# EAGLE schematic OLM7 (EAGLE 6.4)
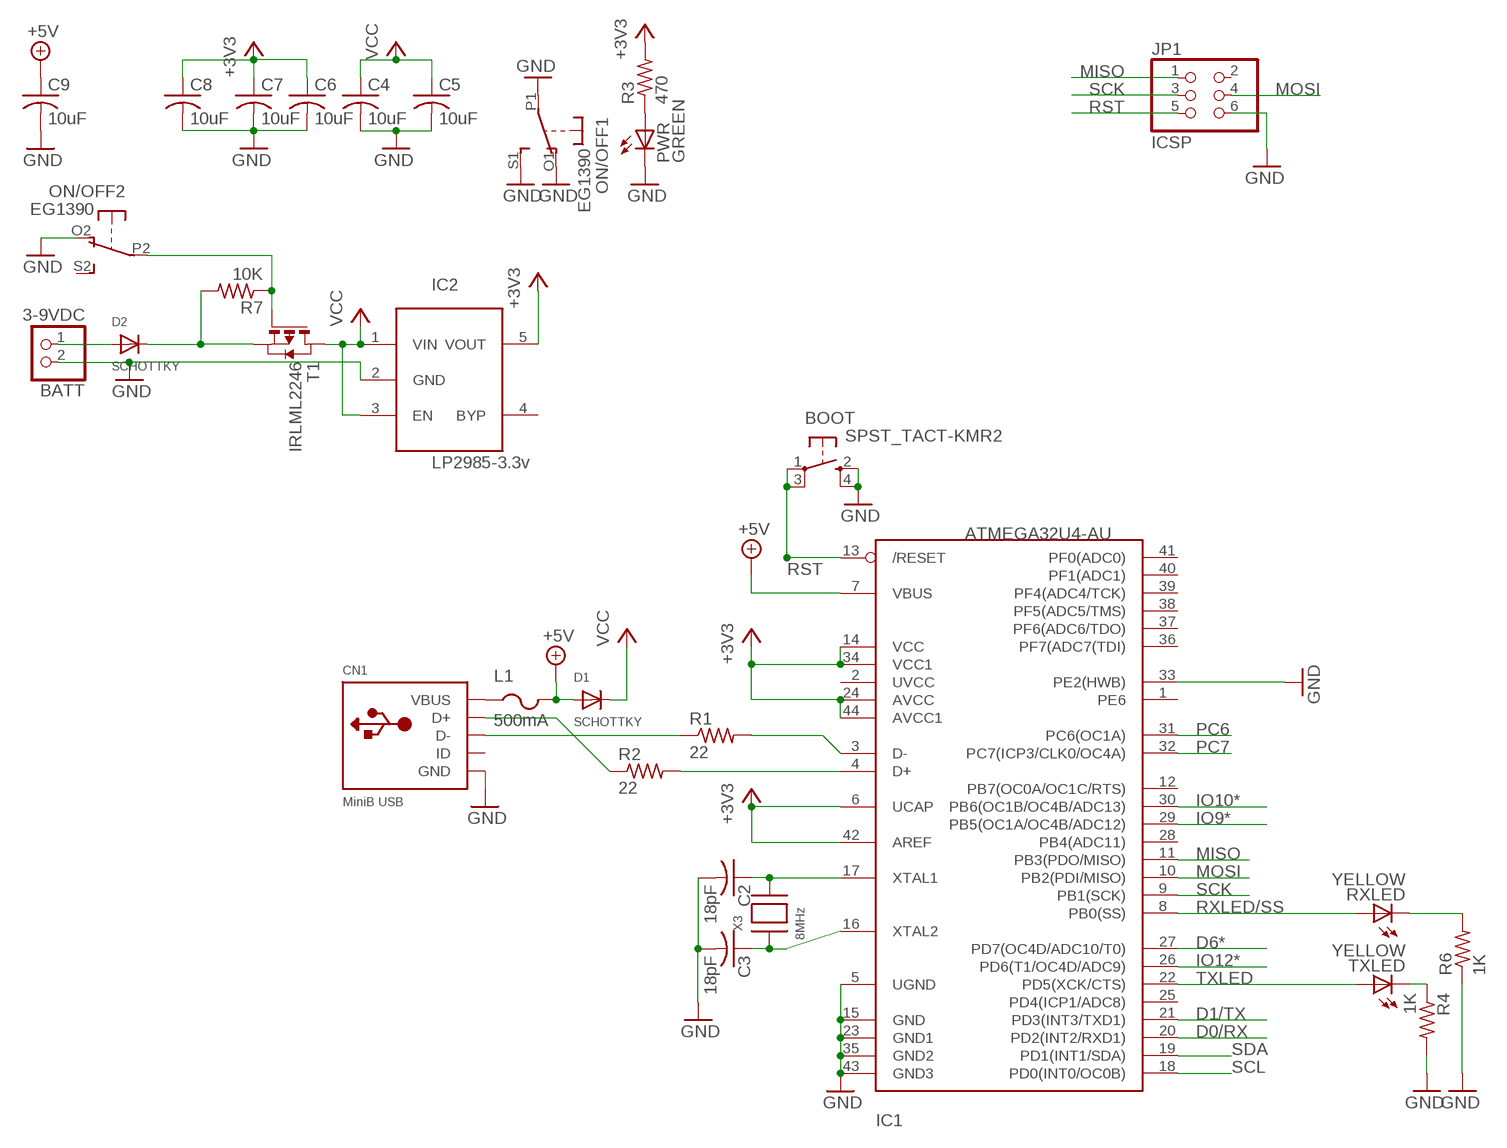
[diagram p0: schematic, sheet 1, part 1 of 2]
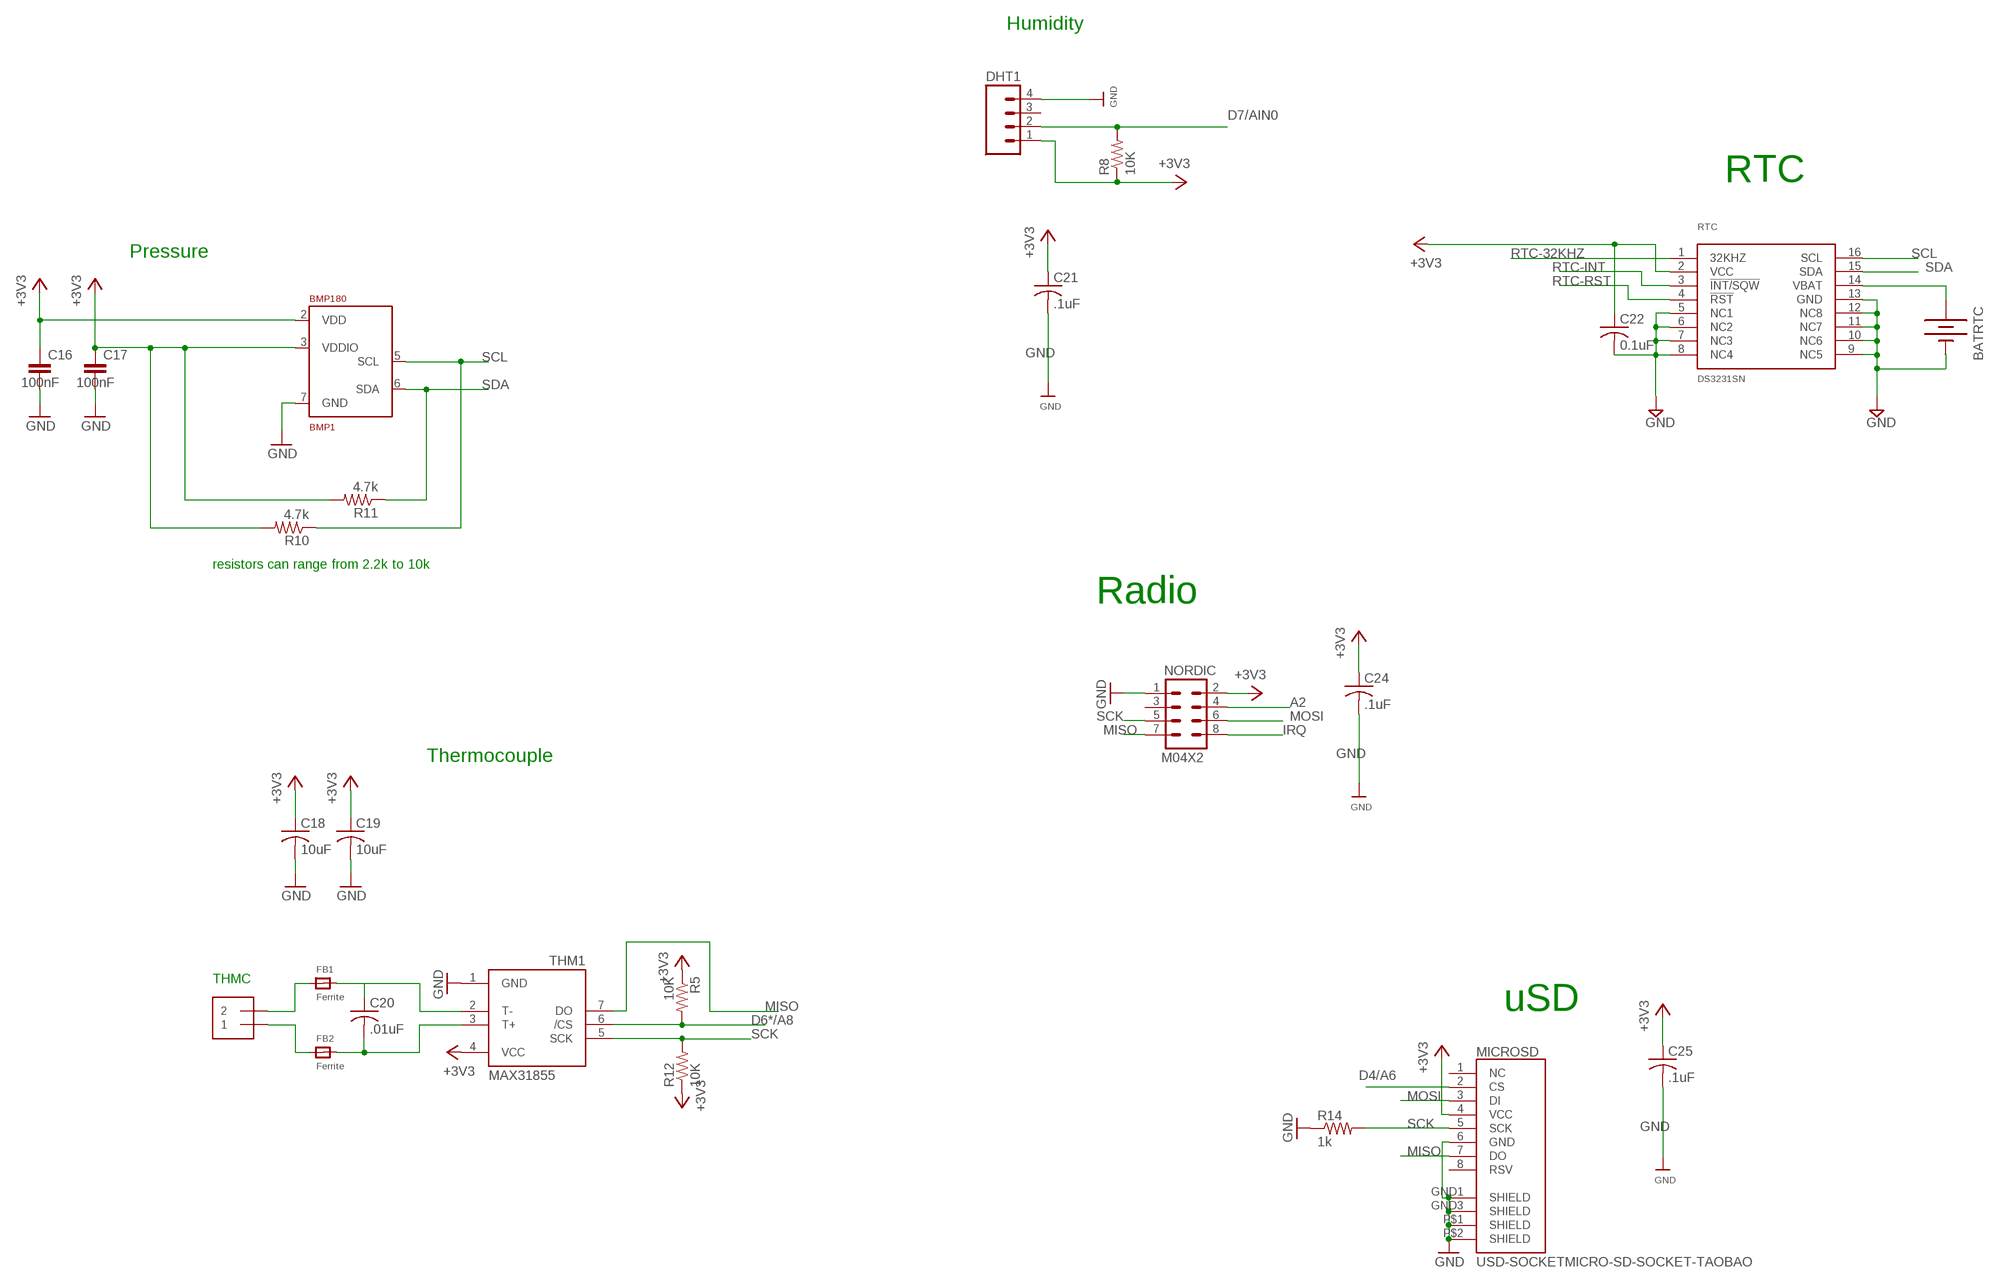
[diagram p1: schematic, sheet 1, part 2 of 2]

## Parts
BATRTC  BATTERYBATTERY_12MM_SMT  [BATTCON_12MM_SMT]
BATT  3-9VDC  JST_2PIN-SMT-RA  [JST-PH-2-SMT-RA]
BMP1  BMP180  [LGA7]
BOOT  SPST_TACT-KMR2  [KMR2]
C2  18pF  C-USC0805K  [C0805K]
C3  18pF  C-USC0805K  [C0805K]
C4  10uF  C-USC0805K  [C0805K]
C5  10uF  C-USC0805K  [C0805K]
C6  10uF  C-USC0805K  [C0805K]
C7  10uF  C-USC0805K  [C0805K]
C8  10uF  C-USC0805K  [C0805K]
C9  10uF  C-USC0805K  [C0805K]
C16  100nF  C-EUC0805  [C0805]
C17  100nF  C-EUC0805  [C0805]
C18  10uF  C-USC0805  [C0805]
C19  10uF  C-USC0805  [C0805]
C20  .01uF  C-USC0805  [C0805]
C21  .1uF  C-USC0805  [C0805]
C22  0.1uF  C-USC0805  [C0805]
C24  .1uF  C-USC0805  [C0805]
C25  .1uF  C-USC0805  [C0805]
CN1  MiniB USB  USBMINIBLARGE  [USB-MINIB_LARGER]
D1  SCHOTTKY  DIODESOD-123  [SOD-123]
D2  SCHOTTKY  DIODESOD-123  [SOD-123]
DHT1  M04LOCK  [1X04_LOCK]
FB1  Ferrite  FERRITE_0805  [_0805]
FB2  Ferrite  FERRITE_0805  [_0805]
IC1  ATMEGA32U4-AU  [TQFP44]
IC2  LP2985-3.3v  LP298XS  [SOT23-5L]
JP1  ICSP  PINHD-2X3  [2X03]
L1  500mA  PTCFUSE-1206  [R1206]
MICROSD  USD-SOCKETMICRO-SD-SOCKET-TAOBAO  [MICRO-SD-SOCKET-TAOBAO]
NORDIC  M04X2  [2X4]
ON/OFF  EG1390  DPDT-EG1390  [EG1390]
PWR  GREEN  LEDCHIPLED_0805  [CHIPLED_0805]
R1  22  R-US_R0805  [R0805]
R2  22  R-US_R0805  [R0805]
R3  470  R-US_R0805  [R0805]
R4  1K  R-US_R0805  [R0805]
R5  10K  R-US_R0805  [R0805]
R6  1K  R-US_R0805  [R0805]
R7  10K  R-US_R0805  [R0805]
R8  10K  R-US_R0805  [R0805]
R10  4.7k  R-US_R0805  [R0805]
R11  4.7k  R-US_R0805  [R0805]
R12  10K  R-US_R0805  [R0805]
R14  1k  R-US_R0805  [R0805]
RTC  DS3231SN  [SO16W]
RXLED  YELLOW  LEDCHIPLED_0805  [CHIPLED_0805]
T1  IRLML2246  PMOSSOT23  [SOT-23]
THM1  MAX31855  MAX6675  [SO08]
THMC  1X2-3.5MM  [1X2-3.5MM]
TXLED  YELLOW  LEDCHIPLED_0805  [CHIPLED_0805]
X3  8MHz  XTALNX5032  [NX5032]

## Nets
+3V3: BMP1.2(VDD) BMP1.3(VDDIO) C6.1 C7.1 C8.1 C16.1 C17.1 C18.1 C19.1 C21.1 C22.1 C24.1 C25.1 DHT1.1 IC1.6(UCAP) IC1.14(VCC) IC1.24(AVCC) IC1.34(VCC1) IC1.42(AREF) IC1.44(AVCC1) IC2.5(VOUT) MICROSD.4(VCC) NORDIC.2 R3.2 R5.1 R8.1 R10.2 R11.2 R12.1 RTC.2(VCC) THM1.4(VCC)
+5V: C9.1 D1.A IC1.7(VBUS) L1.2
A2: NORDIC.4
D0/RX: IC1.20(PD2(INT2/RXD1))
D1/TX: IC1.21(PD3(INT3/TXD1))
D4/A6: MICROSD.2(CS)
D6*: IC1.27(PD7(OC4D/ADC10/T0))
D6*/A8: R5.2 THM1.6(/CS)
D7/AIN0: DHT1.2 R8.2
GND: BATRTC.P$1(-) BATT.2 BMP1.7(GND) BOOT.2(S) BOOT.4(S1) C2.2 C3.2 C4.2 C5.2 C6.2 C7.2 C8.2 C9.2 C16.2 C17.2 C18.2 C19.2 C21.2 C22.2 C24.2 C25.2 CN1.GND DHT1.4 IC1.5(UGND) IC1.15(GND) IC1.23(GND1) IC1.33(PE2(HWB)) IC1.35(GND2) IC1.43(GND3) IC2.2(GND) JP1.6 MICROSD.6(GND) MICROSD.GND1(SHIELD) MICROSD.GND3(SHIELD) MICROSD.P$1(SHIELD) MICROSD.P$2(SHIELD) NORDIC.1 ON/OFF.O1(1:O) ON/OFF.O2(2:O) ON/OFF.P1(1:P) ON/OFF.S1(1:S) PWR.C R4.2 R6.1 R14.1 RTC.5(NC1) RTC.6(NC2) RTC.7(NC3) RTC.8(NC4) RTC.9(NC5) RTC.10(NC6) RTC.11(NC7) RTC.12(NC8) RTC.13(GND) THM1.1(GND)
IO9*: IC1.29(PB5(OC1A/OC4B/ADC12))
IO10*: IC1.30(PB6(OC1B/OC4B/ADC13))
IO12*: IC1.26(PD6(T1/OC4D/ADC9))
IRQ: NORDIC.8
MISO: IC1.11(PB3(PDO/MISO)) JP1.1 MICROSD.7(DO) NORDIC.7 THM1.7(DO)
MOSI: IC1.10(PB2(PDI/MISO)) JP1.4 MICROSD.3(DI) NORDIC.6
N$1: PWR.A R3.1
N$2: CN1.D+ R2.1
N$3: IC1.3(D-) R1.2
N$4: IC1.4(D+) R2.2
N$5: CN1.D- R1.1
N$6: D2.C R7.2 T1.2(S)
N$7: BATT.1 D2.A
N$8: C2.1 IC1.17(XTAL1) X3.P$2
N$9: C3.1 IC1.16(XTAL2) X3.P$1
N$11: R4.1 TXLED.C
N$12: R6.2 RXLED.C
N$13: ON/OFF.P2(2:P) R7.1 T1.3(G)
N$22: BATRTC.P$2(+) RTC.14(VBAT)
N$23: FB1.1 THMC.2
N$24: C20.1 FB1.2 THM1.2(T-)
N$25: FB2.1 THMC.1
N$26: C20.2 FB2.2 THM1.3(T+)
PC6: IC1.31(PC6(OC1A))
PC7: IC1.32(PC7(ICP3/CLK0/OC4A))
RST: BOOT.1(P) BOOT.3(P1) IC1.13(/RESET) JP1.5
RTC-32KHZ: RTC.1(32KHZ)
RTC-INT: RTC.3(!INT/SQW)
RTC-RST: RTC.4(!RST)
RXLED/SS: IC1.8(PB0(SS)) RXLED.A
SCK: IC1.9(PB1(SCK)) JP1.3 MICROSD.5(SCK) NORDIC.5 R12.2 THM1.5(SCK)
SCK1: R14.2
SCL: BMP1.5(SCL) IC1.18(PD0(INT0/OC0B)) R10.1 RTC.16(SCL)
SDA: BMP1.6(SDA) IC1.19(PD1(INT1/SDA)) R11.1 RTC.15(SDA)
TXLED: IC1.22(PD5(XCK/CTS)) TXLED.A
VBUS: CN1.VBUS L1.1
VCC: C4.1 C5.1 D1.C IC2.1(VIN) IC2.3(EN) T1.1(D)
Unconnected: BMP1.1 BMP1.4 CN1.ID DHT1.3 IC1.1(PE6) IC1.2(UVCC) IC1.12(PB7(OC0A/OC1C/RTS)) IC1.25(PD4(ICP1/ADC8)) IC1.28(PB4(ADC11)) IC1.36(PF7(ADC7(TDI)) IC1.37(PF6(ADC6/TDO)) IC1.38(PF5(ADC5/TMS)) IC1.39(PF4(ADC4/TCK)) IC1.40(PF1(ADC1)) IC1.41(PF0(ADC0)) IC2.4(BYP) JP1.2 MICROSD.1(NC) MICROSD.8(RSV) NORDIC.3 ON/OFF.S2(2:S)

## Notes on the sheet
- Humidity
- RTC
- Pressure
- resistors can range from 2.2k to 10k
- Radio
- Thermocouple
- THMC
- uSD

## Library data of the parts
BATRTC = SparkFunNew:BATTERY: Battery Holders Various common sizes : AA, AAA, 20mm coin cell and 12mm coin cell.
BATT = adafruit:JST_2PIN: JST 2-Pin Connectors of various flavors SMT-RA (S2B-PH-SM4) 4UConnector #17311 SMT (B2B-PH-SM4) THM-RA (S2B-PH) THM (B2B-PH)
BMP1 = DSSCircuits:BMP180; I2C: I2C
BOOT = adafruit:SPST_TACT: SMT 6mm switch, EVQQ2 series http://www.ladyada.net/library/eagle
C2-C9 C18-C21 C24 C25 = adafruit:C-US: CAPACITOR, American symbol
C16 C17 = resistor:C-EU: CAPACITOR, European symbol
C22 = rcl:C-US: CAPACITOR, American symbol
CN1 = microbuilder:USB: USB Connectors USBMINIB - Surface Mount Female Mini-B USB Connector 4UConnector: 06564
D1 D2 = adafruit:DIODE: Diode SMADIODE - SMA Surface Mount Package 20V 1A Schottky Diode Digikey: 641-1014-6-ND DO-1N4148 - Through Hole Small Current Diode SOD-123 20V 1 A (.5mV Vf) Schottky Diode - Digikey: MBRX120TPMSCT-ND SOD-323 10V 570mA (.38mV Vf, 3ns) Schottky Diode - Digikey: ZLLS410CT-ND SOD-523 30V 30mA Schottky Diode (RB751S-40TE61) - Digikey: RB751S-40TE61CT-ND SOT23-R/W - SOT23 Package (R = Solder Paste/Reflow Ovens, W = Hand-Soldering) BAT54Film 40V 300mA - Digikey: 497-7162-1-ND
DHT1 = SparkFun-Connectors:M04: Header 4 Standard 4-pin 0.1" header. Use with straight break away headers (SKU : PRT-00116), right angle break away headers (PRT-00553), swiss pins (PRT-00743), machine pins (PRT-00117), and female headers (PRT-00115). Molex polarized connector foot print use with SKU : PRT-08231 with associated crimp pins and housings. 1MM SMD Version SKU: PRT-10208
FB1 FB2 = microbuilder:FERRITE: Ferrite Bead 0603 MMZ1608B121C - 120 Ohm @ 100MHz, 600mA, 0.15 Ohm DC Resistance - Digikey: 445-2164-1-ND BK1608HW121-T - 120 Ohm, 600mA Ferrite Chip - Digikey: 587-1876-2-ND 0805 HZ0805B272R-10 - 2.7K Ohm @ 100MHz, 200mA, 0.8 Ohm DC Resistance - Digikey: 240-2504-1-ND (see also Murata BLM21BD272SN1L) MMZ2012Y152B - 1.5K Ohm @ 100MHz, 500mA, 0.4 Ohm DC Resistance - Digikey: 445-1560-1-ND - Mainly for high frequency (80-400MHz) MMZ2012R102A - 1K Ohm @ 100MHz, 500mA, 0.3 Ohm DC Resistance - Digikey: 445-1555-2-ND - More general purpose (10-200MHz)
IC1 = adaprog:ATMEGA32U4
IC2 = adafruit:LP298X
JP1 = pinhead:PINHD-2X3: PIN HEADER
L1 = adafruit:PTCFUSE: PTC fuses, resettable thermistors
MICROSD = SparkFunNew:USD-SOCKET: microSD Socket Push-push type uSD socket. Schematic element and footprint production proven. Spark Fun Electronics SKU : PRT-00127. tDoc lines correctly indicate media card edge positions when inserting (unlocked, locked, depressed).
NORDIC = SparkFun-Connectors:M04X2: .1" header, two rows of four.
ON/OFF = adafruit:DPDT
PWR RXLED TXLED = adafruit:LED: LED OSRAM: - CHIPLED LG R971, LG N971, LY N971, LG Q971, LY Q971, LO R971, LY R971 LH N974, LH R974 LS Q976, LO Q976, LY Q976 LO Q996 - Hyper CHIPLED LW Q18S LB Q993, LB Q99A, LB R99A - SideLED LS A670, LO A670, LY A670, LG A670, LP A670 LB A673, LV A673, LT A673, LW A673 LH A674 LY A675 LS A676, LA A676, LO A676, LY A676, LW A676 LS A679, LY A679, LG A679 - Hyper Micro SIDELED® LS Y876, LA Y876, LO Y876, LY Y876 LT Y87S - SmartLED LW L88C, LW L88S LB L89C, LB L89S, LG L890 LS L89K, LO L89K, LY L89K LS L896, LA L896, LO L896, LY L896 - TOPLED LS T670, LO T670, LY T670, LG T670, LP T670 LSG T670, LSP T670, LSY T670, LOP T670, LYG T670 LG T671, LOG T671, LSG T671 LB T673, LV T673, LT T673, LW T673 LH T674 LS T676, LA T676, LO T676, LY T676, LB T676, LH T676, LSB T676, LW T676 LB T67C, LV T67C, LT T67C, LS T67K, LO T67K, LY T67K, LW E67C LS E67B, LA E67B, LO E67B, LY E67B, LB E67C, LV E67C, LT E67C LW T67C LS T679, LY T679, LG T679 LS T770, LO T770, LY T770, LG T770, LP T770 LB T773, LV T773, LT T773, LW T773 LH T774 LS E675, LA E675, LY E675, LS T675 LS T776, LA T776, LO T776, LY T776, LB T776 LHGB T686 LT T68C, LB T68C - Hyper Mini TOPLED® LB M676 - Mini TOPLED Santana® LG M470 LS M47K, LO M47K, LY M47K Source: http://www.osram.convergy.de/
R1-R8 R10-R12 R14 = adafruit:R-US_: RESISTOR, American symbol
RTC = comfile:DS3231SN
T1 = zetex:PMOSSOT23: MOS FET
THM1 = adafruit:MAX6675
THMC = adafruit:1X2: 3.5mm Terminal block http://www.ladyada.net/library/pcb/eaglelibrary.html
X3 = adaprog:XTAL